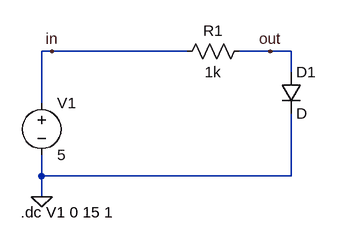
[diagram p0: schematic Simulation plot showing diode I–V.asc]
Simulation plot showing diode I–V.asc, the LTspice schematic file:
Version 4.1
SHEET 1 880 680
WIRE -80 80 -96 80
WIRE 128 80 -80 80
WIRE 256 80 208 80
WIRE 288 80 256 80
WIRE 288 112 288 80
WIRE -96 160 -96 80
WIRE -96 272 -96 240
WIRE 288 272 288 176
WIRE 288 272 -96 272
WIRE -96 304 -96 272
FLAG -96 304 0
FLAG -80 80 in
FLAG 256 80 out
SYMBOL voltage -96 144 R0
SYMATTR InstName V1
SYMATTR Value 5
SYMBOL res 224 64 R90
WINDOW 0 0 56 VBottom 2
WINDOW 3 32 56 VTop 2
SYMATTR InstName R1
SYMATTR Value 1k
SYMBOL diode 272 112 R0
SYMATTR InstName D1
TEXT -128 328 Left 2 !.dc V1 0 15 1

The netlist it stands for:
* Simulation plot showing diode I–V.asc
V1 in 0 5
R1 out in 1k
D1 out 0 D
.model D D
.lib standard.dio
.dc V1 0 15 1
.backanno
.end